# EAGLE design main_V1.2 (EAGLE 9.6.2)
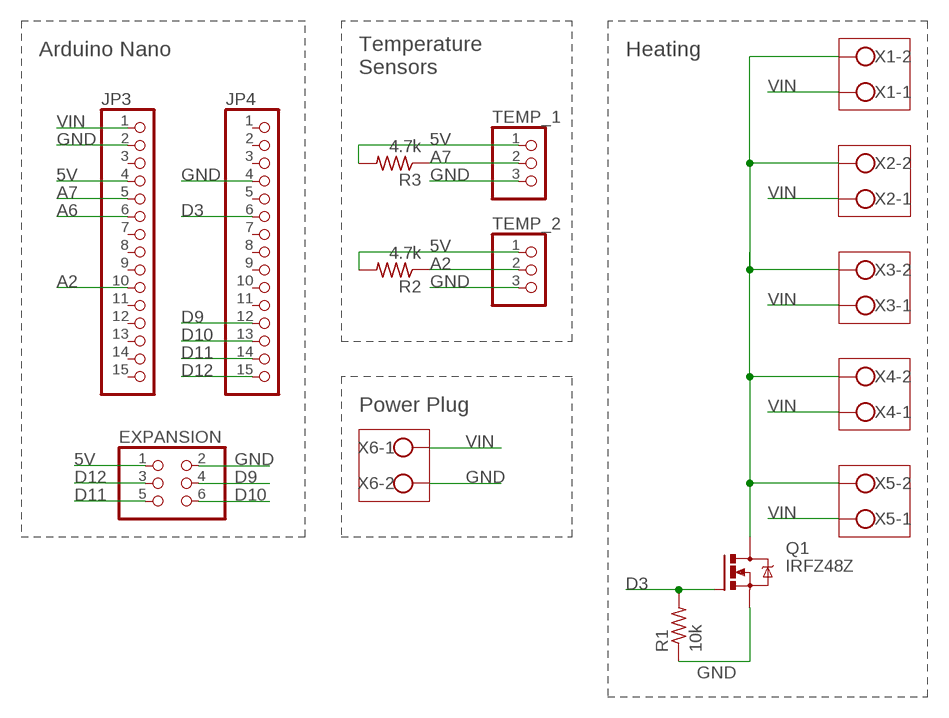
[diagram p0: schematic, sheet 1]

## Parts
EXPANSION  PINHD-2X3  [2X03]
JP3  PINHD-1X15-CB  [1X15-CB]
JP4  PINHD-1X15-CB  [1X15-CB]
Q1  IRFZ48Z  [TO220BH]
R1  10k  R-US_0204/7  [0204/7]
R2  4.7k  R-US_0204/7  [0204/7]
R3  4.7k  R-US_0204/7  [0204/7]
TEMP_1  PINHD-1X3  [1X03]
TEMP_2  PINHD-1X3  [1X03]
X1  W237-102  [W237-102]
X2  W237-102  [W237-102]
X3  W237-102  [W237-102]
X4  W237-102  [W237-102]
X5  W237-102  [W237-102]
X6  W237-102  [W237-102]

## Nets
5V: EXPANSION.1 JP3.4 R2.2 R3.2 TEMP_1.1 TEMP_2.1
A2: JP3.10 R2.1 TEMP_2.2
A6: JP3.6
A7: JP3.5 R3.1 TEMP_1.2
D3: JP4.6 Q1.G R1.2
D9: EXPANSION.4 JP4.12
D10: EXPANSION.6 JP4.13
D11: EXPANSION.5 JP4.14
D12: EXPANSION.3 JP4.15
GND: EXPANSION.2 JP3.2 JP4.4 Q1.S R1.1 TEMP_1.3 TEMP_2.3 X6.2
N$1: Q1.D X1.2 X2.2 X3.2 X4.2 X5.2
VIN: JP3.1 X1.1 X2.1 X3.1 X4.1 X5.1 X6.1
Unconnected: JP3.3 JP3.7 JP3.8 JP3.9 JP3.11 JP3.12 JP3.13 JP3.14 JP3.15 JP4.1 JP4.2 JP4.3 JP4.5 JP4.7 JP4.8 JP4.9 JP4.10 JP4.11

## Notes on the sheet
- Arduino Nano | Heating
- Temperature
  Sensors
- Power Plug

## Library data of the parts
EXPANSION = pinhead:PINHD-2X3: PIN HEADER
JP3 JP4 = adafruit:PINHD-1X15: PIN HEADER
Q1 = transistor-power:IRFZ48: N Channel HEXFET® Power MOSFET Logic Level Source: http://www.irf.com/product-info/datasheets/data/irfz48z.pdf
R1-R3 = rcl:R-US_: RESISTOR, American symbol; SPICEPREFIX: R
TEMP_1 TEMP_2 = adafruit:PINHD-1X3: PIN HEADER
X1-X6 = con-wago-500:W237-102: WAGO SCREW CLAMP; MPN: 237-102; OC_FARNELL: unknown; OC_NEWARK: 70K9898

## Board
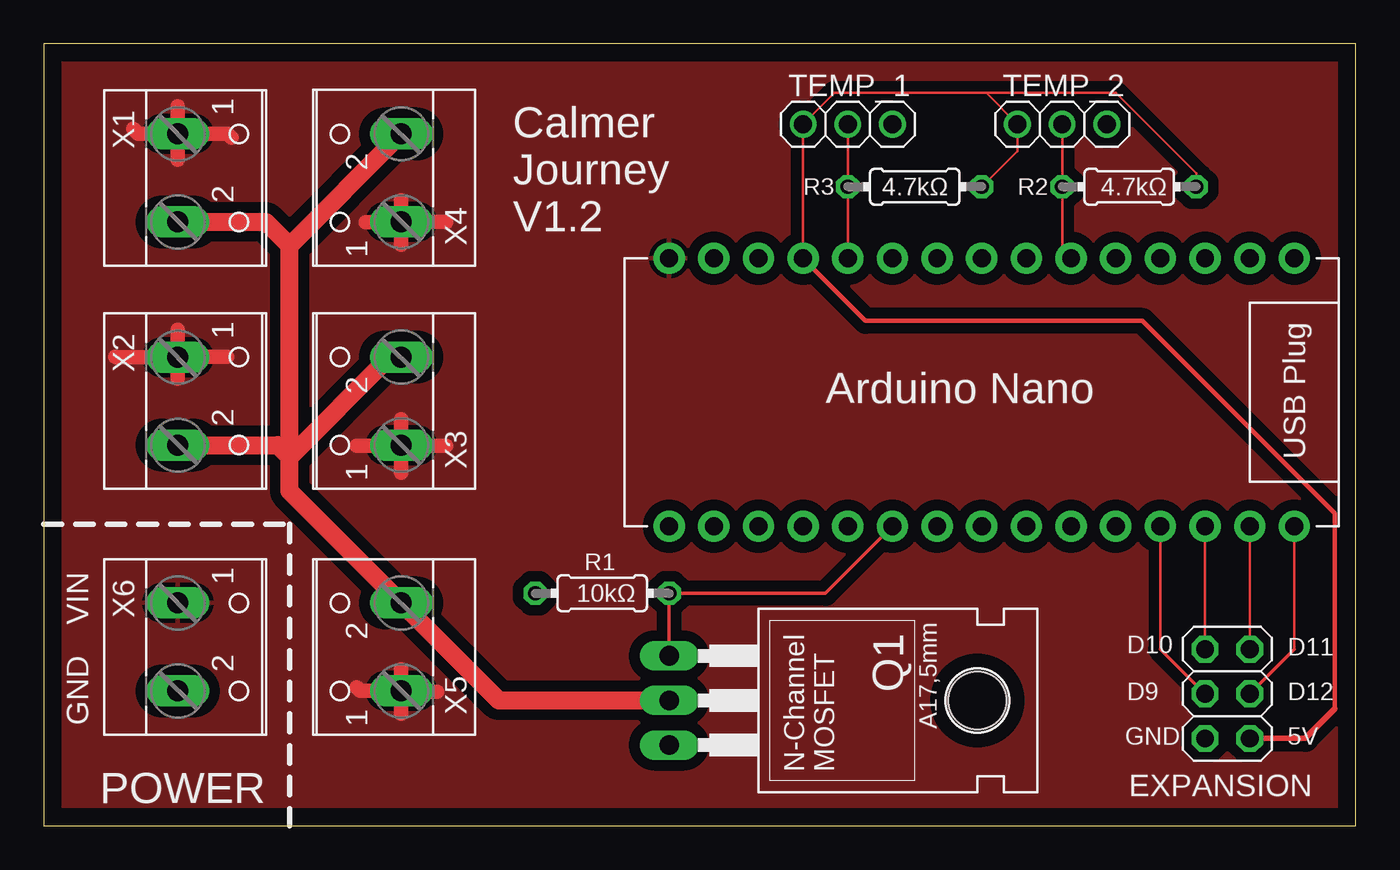
[diagram p1: board, top side]
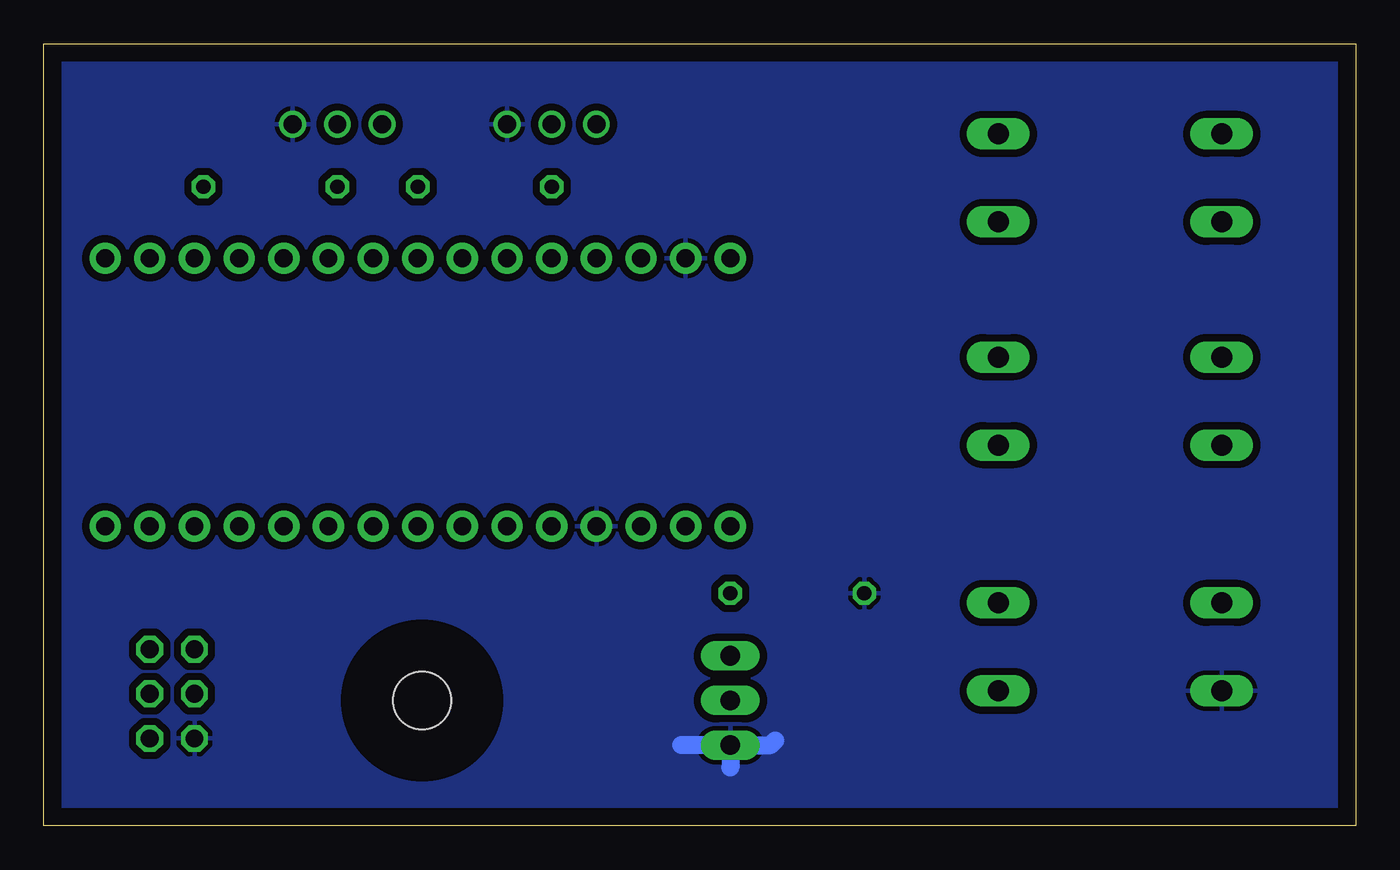
[diagram p2: board, bottom side, seen from below]

Size 74.6 x 44.44 mm. Coordinates in mm from the lower left corner, seen from the top.
Outline: 0,0 74.6,0 74.6,44.44 0,44.44 0,0
Copper layers (1*16): Top 0.035mm / dielectric 1.5mm / Bottom 0.035mm
Design rules "default": minimum track width 6mil, minimum drill 0.35mm, track to track 6mil, track to pad 6mil, pad to pad 6mil, via to via 6mil, smd to smd 6mil, copper to edge 40mil, drill to drill 6mil, minimum pad ring 10mil, minimum via ring 8mil, stop-mask expansion 4mil, vias tented up to drill 0mil, thermal gap 10mil

### Footprints (pad centres in the part's own frame; a part is rotated, then mirrored left to right if it is on the bottom)
2X03 = drill 1.016 octagon: 1 -2.54,-1.27; 2 -2.54,1.27; 3 0,-1.27; 4 0,1.27; 5 2.54,-1.27; 6 2.54,1.27
1X15-CB = drill 1.016 pad 1.778: 1 -17.78,0; 2 -15.24,0; 3 -12.7,0; 4 -10.16,0; 5 -7.62,0; 6 -5.08,0; 7 -2.54,0; 8 0,0; 9 2.54,0; 10 5.08,0; 11 7.62,0; 12 10.16,0; 13 12.7,0; 14 15.24,0; 15 17.78,0
TO220BH = drill 1.118 long: D 0,-6.35; G -2.54,-6.35; S 2.54,-6.35 | hole 3.302: 0,11.176
0204/7 = drill 0.813 octagon: 1 -3.81,0; 2 3.81,0
1X03 = drill 1.016: 1 -2.54,0; 2 0,0; 3 2.54,0
W237-102 = drill 1.194 long: 1 -2.5,-1.27; 2 2.5,-1.27

### Placement (x,y rotation side)
EXPANSION  67.31,7.49 90 top
JP3  53.34,32.26 0 top
JP4  53.34,17.02 0 top
Q1  41.91,7.11 270 top
R1  31.75,13.21 0 top
R2  61.72,36.32 0 top
R3  49.53,36.32 0 top
TEMP_1  45.72,39.88 0 top
TEMP_2  57.91,39.88 0 top
X1  8.89,36.83 270 top
X2  8.89,24.13 270 top
X3  19.05,24.13 90 top
X4  19.05,36.83 90 top
X5  19.05,10.16 90 top
X6  8.89,10.16 270 top

### Tracks (layer width: path | path; a pad name or v marks a point on that pad's centre or on a via)
5V
  Top 0.152: JP3.4 TEMP_1.1 44.96,41.66 53.59,41.66 | 53.59,41.66 TEMP_2.1 55.37,38.35 R3.2 | 53.59,41.66 60.96,41.66 65.53,37.08 R2.2
  Top 0.254: 73.43,6.63 73.43,17.75 62.48,28.7 46.74,28.7 JP3.4
  Top 0.305: EXPANSION.1 71.75,4.95 73.43,6.63
A2
  Top 0.152: TEMP_2.2 R2.1 57.91,32.77 JP3.10
A7
  Top 0.152: JP3.5 R3.1 TEMP_1.2
D3
  Top 0.203: JP4.6 44.45,13.21 R1.2 Q1.G
D9
  Top 0.152: JP4.12 63.5,10.03
  Top 0.203: 63.5,10.03 EXPANSION.4
D10
  Top 0.152: JP4.13 EXPANSION.6
D11
  Top 0.152: JP4.14 EXPANSION.5
D12
  Top 0.152: JP4.15 71.12,10.03
  Top 0.203: 71.12,10.03 71.06,9.97 EXPANSION.3
GND
  Bottom 1.016: Q1.S 33.27,4.57 33.02,4.83 | Q1.S 38.35,4.57 | Q1.S 35.56,3.3
  pour Bottom (isolate 0.406): 0,44.45 74.93,44.45 74.93,0 0,0
N$1
  Top 1.016: 13.97,20.96 13.97,19.01 X5.2 25.87,7.11 Q1.D | 13.97,20.96 19.64,26.63 X3.2 | 13.97,20.96 13.97,32.98 | 13.97,32.98 X4.2 | X1.2 12.62,34.33 13.97,32.98 | X2.2 13.29,21.63 13.97,20.96
VIN
  Top 0.813: X2.1 4.1,26.63 4.06,26.67 | X2.1 7.66,26.67 10.41,26.67 | X2.1 7.62,28.19 | X2.1 7.62,25.4 | X1.1 5.37,39.33 5.08,39.62 | X1.1 10.45,39.33 10.67,39.12 | X1.1 7.62,40.89 | X1.1 7.62,37.85 | X4.1 20.28,34.29 18.29,34.29 | X4.1 22.82,34.33 22.86,34.29 | X4.1 20.32,35.56 | X4.1 20.32,33.02 | X3.1 20.36,21.59 22.86,21.59 | X3.1 20.32,23.11 | X3.1 20.28,21.59 17.78,21.59 | X3.1 20.32,20.07 | X5.1 20.36,7.62 22.35,7.62 | X5.1 20.32,8.89 | X5.1 17.99,7.66 17.78,7.87 | X5.1 20.32,6.35
  pour Top (isolate 0.61): 0,44.45 74.93,44.45 74.93,0 0,0

### Text on the board
tPlace: 4.7kΩ | 4.7kΩ | Calmer / Journey / V1.2 | Arduino Nano | USB Plug | 10kΩ | VIN | D10 | D11 | D9 | D12 | GND | GND | 5V | N-Channel / MOSFET | POWER